# Altium schematic sheet CAN2XG_TCAN.SchDoc
size 431 x 279 mm; Organization: ORGANIZATION; Address1: ADDRESS 1; Address2: ADDRESS 2; Address3: ADDRESS 3; Address4: ADDRESS 4; Revision: -; ENG_APP_DATE: --/--/--; DSN_APP_DATE: --/--/--; CHK_APP_DATE: --/--/--
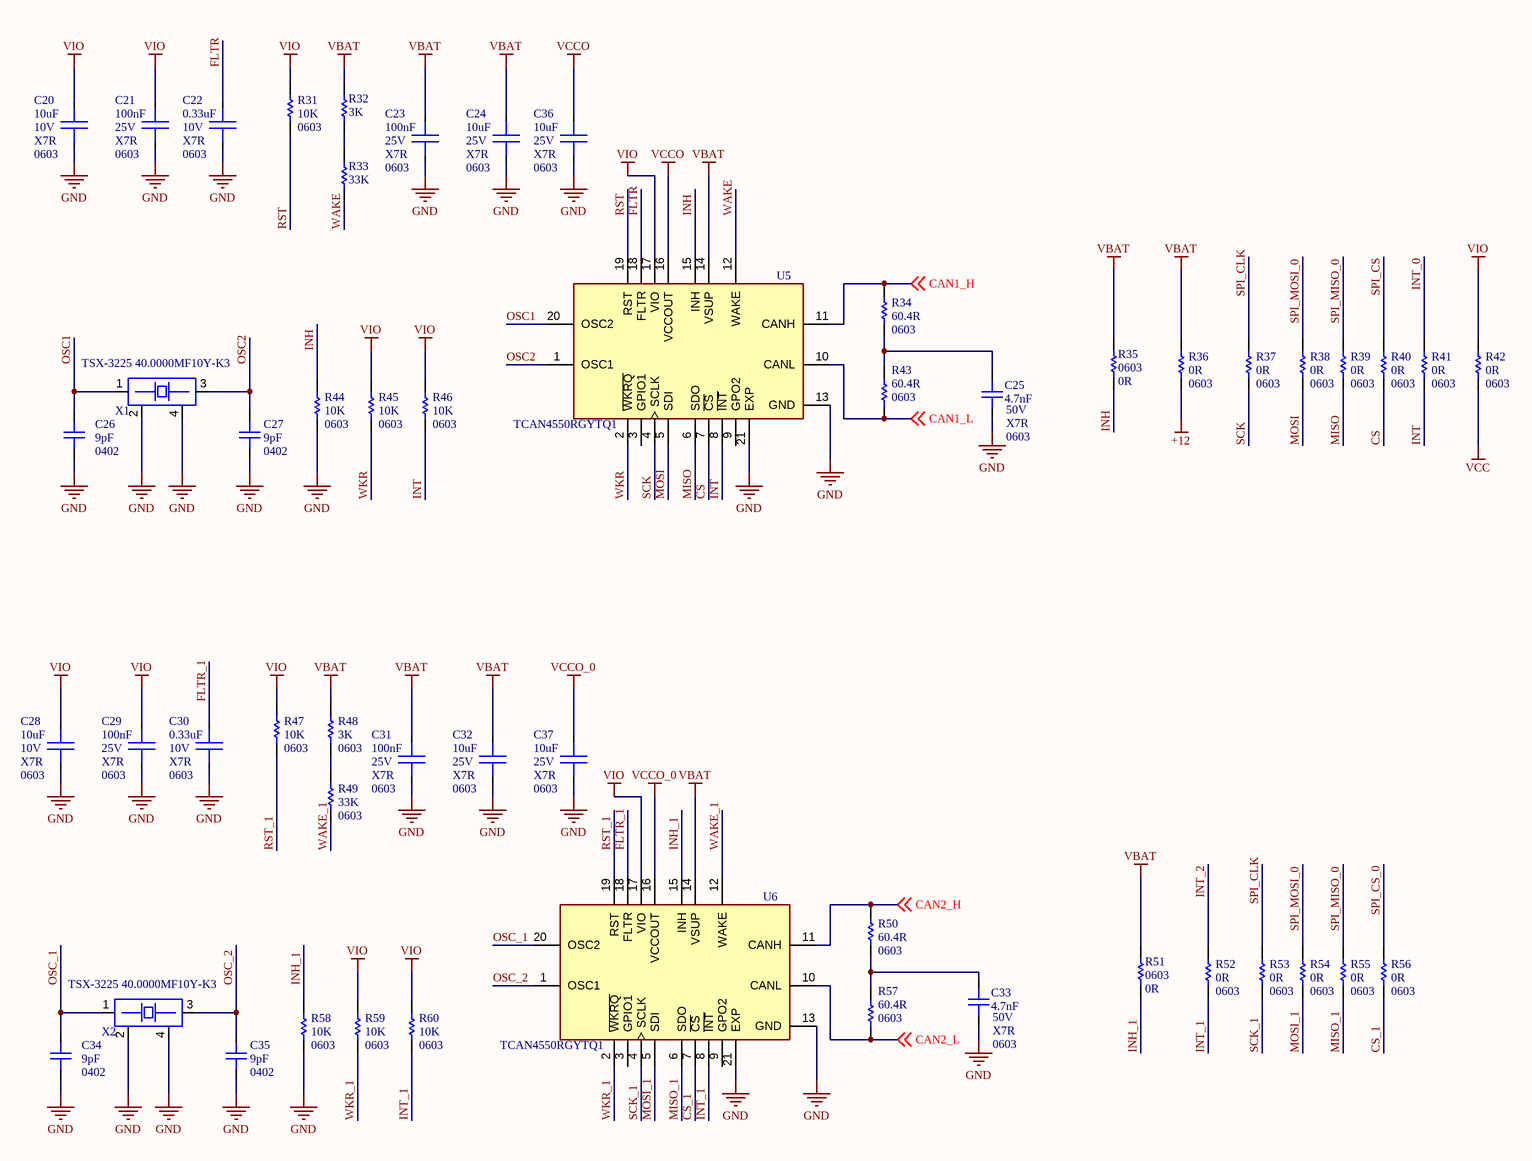
[diagram p0: CAN2XG_TCAN.SchDoc]

## Parts
C20  value 10uF  Voltage: 10V  Dielectirc: X7R  Case/Package: 0603  [CAP-0603]
C21  value 100nF  Voltage: 25V  Dielectirc: X7R  Case/Package: 0603  [CAP-0603]
C22  value 0.33uF  Voltage: 10V  Dielectirc: X7R  Case/Package: 0603  [CAP-0603]
C23  value 100nF  Voltage: 25V  Dielectirc: X7R  Case/Package: 0603  [CAP-0603]
C24  value 10uF  Voltage: 25V  Dielectirc: X7R  Case/Package: 0603  [CAP-0603]
C25  value 4.7nF  Voltage: 50V  Dielectric: X7R  Case/Package: 0603  [CAP-0603]
C26  value 9pF  Case/Package: 0402  [CAPC0402]
C27  value 9pF  Case/Package: 0402  [CAPC0402]
C28  value 10uF  Voltage: 10V  Dielectirc: X7R  Case/Package: 0603  [CAP-0603]
C29  value 100nF  Voltage: 25V  Dielectirc: X7R  Case/Package: 0603  [CAP-0603]
C30  value 0.33uF  Voltage: 10V  Dielectirc: X7R  Case/Package: 0603  [CAP-0603]
C31  value 100nF  Voltage: 25V  Dielectirc: X7R  Case/Package: 0603  [CAP-0603]
C32  value 10uF  Voltage: 25V  Dielectirc: X7R  Case/Package: 0603  [CAP-0603]
C33  value 4.7nF  Voltage: 50V  Dielectric: X7R  Case/Package: 0603  [CAP-0603]
C34  value 9pF  Case/Package: 0402  [CAPC0402]
C35  value 9pF  Case/Package: 0402  [CAPC0402]
C36  value 10uF  Voltage: 25V  Dielectirc: X7R  Case/Package: 0603  [CAP-0603]
C37  value 10uF  Voltage: 25V  Dielectirc: X7R  Case/Package: 0603  [CAP-0603]
R31  value 10K  Case/Package: 0603  [RESC0603]
R32  value 3K  [RESC0603]
R33  value 33K  [RESC0603]
R34  value 60.4R  Case/Package: 0603  [RESC0603]
R35  value 0R  Case/Package: 0603  [RESC0603]  (no BOM)
R36  value 0R  Case/Package: 0603  [RESC0603]
R37  value 0R  Case/Package: 0603  [RESC0603]
R38  value 0R  Case/Package: 0603  [RESC0603]
R39  value 0R  Case/Package: 0603  [RESC0603]
R40  value 0R  Case/Package: 0603  [RESC0603]
R41  value 0R  Case/Package: 0603  [RESC0603]
R42  value 0R  Case/Package: 0603  [RESC0603]
R43  value 60.4R  Case/Package: 0603  [RESC0603]
R44  value 10K  Case/Package: 0603  [RESC0603]
R45  value 10K  Case/Package: 0603  [RESC0603]
R46  value 10K  Case/Package: 0603  [RESC0603]
R47  value 10K  Case/Package: 0603  [RESC0603]
R48  value 3K  Case/Package: 0603  [RESC0603]
R49  value 33K  Case/Package: 0603  [RESC0603]
R50  value 60.4R  Case/Package: 0603  [RESC0603]
R51  value 0R  Case/Package: 0603  [RESC0603]  (no BOM)
R52  value 0R  Case/Package: 0603  [RESC0603]
R53  value 0R  Case/Package: 0603  [RESC0603]
R54  value 0R  Case/Package: 0603  [RESC0603]
R55  value 0R  Case/Package: 0603  [RESC0603]
R56  value 0R  Case/Package: 0603  [RESC0603]
R57  value 60.4R  Case/Package: 0603  [RESC0603]
R58  value 10K  Case/Package: 0603  [RESC0603]
R59  value 10K  Case/Package: 0603  [RESC0603]
R60  value 10K  Case/Package: 0603  [RESC0603]
U5  (no value)  [IC_TCAN4550RGYTQ1]
U6  (no value)  [IC_TCAN4550RGYTQ1]
X1  Manufacturer Part Number: TSX-3225 40.0000MF10Y-K3  [Crystal_3225]
X2  Manufacturer Part Number: TSX-3225 40.0000MF10Y-K3  [Crystal_3225]

## Nets
+12: R36.1
GND: C20.1 C21.1 C22.1 C23.1 C24.1 C25.1 C26.1 C27.1 C28.1 C29.1 C30.1 C31.1 C32.1 C33.1 C34.1 C35.1 C36.1 C37.1 R44.1 R58.1 U5.13(GND) U5.21(EXP) U6.13(GND) U6.21(EXP) X1.2 X1.4 X2.2 X2.4
VBAT: C23.2 C24.2 C31.2 C32.2 R32.2 R35.1 R36.2 R48.2 R51.1 U5.14(VSUP) U6.14(VSUP)
VCC: R42.1
VCCO: C36.2 U5.16(VCCOUT)
VCCO_0: C37.2 U6.16(VCCOUT)
VIO: C20.2 C21.2 C28.2 C29.2 R31.2 R42.2 R45.2 R46.2 R47.2 R59.2 R60.2 U5.17(VIO) U6.17(VIO)
CAN1_H: R34.2 U5.11(CANH) ; off-sheet CAN1_H
CAN1_L: R43.1 U5.10(CANL) ; off-sheet CAN1_L
CAN2_H: R50.2 U6.11(CANH) ; off-sheet CAN2_H
CAN2_L: R57.1 U6.10(CANL) ; off-sheet CAN2_L
CS: R40.1 U5.7(~{CS})
CS_1: R56.1 U6.7(~{CS})
FLTR: C22.2 U5.18(FLTR)
FLTR_1: C30.2 U6.18(FLTR)
INH: R35.2 R44.2 U5.15(INH)
INH_1: R51.2 R58.2 U6.15(INH)
INT: R41.1 R46.1 U5.8(~{INT})
INT_0: R41.2
INT_1: R52.1 R60.1 U6.8(~{INT})
INT_2: R52.2
MISO: R39.1 U5.6(SDO)
MISO_1: R55.1 U6.6(SDO)
MOSI: R38.1 U5.5(SDI)
MOSI_1: R54.1 U6.5(SDI)
OSC1: C26.2 U5.20(OSC2) X1.1
OSC2: C27.2 U5.1(OSC1) X1.3
OSC_1: C34.2 U6.20(OSC2) X2.1
OSC_2: C35.2 U6.1(OSC1) X2.3
RST: R31.1 U5.19(RST)
RST_1: R47.1 U6.19(RST)
SCK: R37.1 U5.4(SCLK)
SCK_1: R53.1 U6.4(SCLK)
SPI_CLK: R37.2 R53.2
SPI_CS: R40.2
SPI_CS_0: R56.2
SPI_MISO_0: R39.2 R55.2
SPI_MOSI_0: R38.2 R54.2
WAKE: R33.1 U5.12(WAKE)
WAKE_1: R49.1 U6.12(WAKE)
WKR: R45.1 U5.2(~{WKRQ})
WKR_1: R59.1 U6.2(~{WKRQ})
NetC25_2: C25.2 R34.1 R43.2
NetC33_2: C33.2 R50.1 R57.2
NetR32_1: R32.1 R33.2
NetR48_1: R48.1 R49.2

Not connected (* = marked no-connect by the designer): U5 3(GPIO1) 9(GPO2); U6 3(GPIO1) 9(GPO2)

## Notes on the sheet
- DWG. NO.
- REV.
- SHT.
- THIS DOCUMENT AND THE DATA DISCLOSED HEREIN OR HEREWITH IS THE PROPERTY OF ALTIUM LIMITED AND MAY BE FREELY DISTRIBUTED IN WHOLE. NO RIGHTS ARE RESERVED OR EXPRESS OR IMPLIED WARANTEE GIVEN.
- REVISION
- DESCRIPTION
- DATE
- APPROVED
- ENG:
- APPROVALS
- PROJECT
- DSN:
- CHK:
- REFERENCE DOCUMENTS
- PROJECT REVISION:
- TITLE
- DOCUMENT REVISION:
- DESIGN ITEM:
- BOM:
- FAB DWG:
- PCB DWG:
- ASSY DWG:
- SCALE:
- SIZE
- B
- CAGE CODE
- FILE NAME
- DWG NO.
- SHEET
- OF
- REV

## Library data of the parts
C20 C24 C28 C32 C36 C37 = C10uF  0603: CAP CER 10uF 25V  0603
C21 C23 C29 C31 = C10uF  0603: CAP CER 100nF 25V X7R 0603
C22 C30 = C10uF  0603: CAP CER 0.33uF 10V  0603
C25 C33 = CS0805KRX7RYBB472: CAP CER 4.7nF 50V X7R 0603; ComponentLink1URL: https://datasheet.ciiva.com/204/cx7r-204728.pdf?src-supplier=Digi-Key; ComponentLink1Description: https://datasheet.ciiva.com/204/cx7r-204728.pdf?src-supplier=Digi-Key; ComponentLink2URL: https://datasheet.ciiva.com/5418/cx7r-218113-5418187.pdf?src-supplier=Mouser; ComponentLink2Description: https://datasheet.ciiva.com/5418/cx7r-218113-5418187.pdf?src-supplier=Mouser
C26 C27 C34 C35 = CQ0805BRNPOYBN8R2: CAP CER 9PF 50V X7R 0402; ComponentLink1URL: https://datasheet.ciiva.com/204/cx7r-204728.pdf?src-supplier=Digi-Key; ComponentLink1Description: https://datasheet.ciiva.com/204/cx7r-204728.pdf?src-supplier=Digi-Key; ComponentLink2URL: https://datasheet.ciiva.com/5418/cx7r-218113-5418187.pdf?src-supplier=Mouser; ComponentLink2Description: https://datasheet.ciiva.com/5418/cx7r-218113-5418187.pdf?src-supplier=Mouser; Voltage: 50V
R31 R44-R47 R58-R60 = ERJ6ENF1002V: Thick Film Resistor -  10K, 1%, 0603
  R45 R46 R59 R60: ComponentLink1URL: https://datasheet.ciiva.com/11808/0900766b80f80784-11808080.pdf?src-supplier=RSComponents; ComponentLink1Description: https://datasheet.ciiva.com/11808/0900766b80f80784-11808080.pdf?src-supplier=RSComponents; ComponentLink2URL: https://datasheet.ciiva.com/16514/aoa0000ce2-16514021.pdf?src-supplier=Avnet+Asia; ComponentLink2Description: https://datasheet.ciiva.com/16514/aoa0000ce2-16514021.pdf?src-supplier=Avnet+Asia; ComponentLink3URL: https://datasheet.ciiva.com/27055/1988971-27055733.pdf?src-supplier=Jameco; ComponentLink3Description: https://datasheet.ciiva.com/27055/1988971-27055733.pdf?src-supplier=Jameco; ComponentLink4URL: https://datasheet.ciiva.com/16759/70260748-16759350.pdf?src-supplier=Allied+Electronics; ComponentLink4Description: https://datasheet.ciiva.com/16759/70260748-16759350.pdf?src-supplier=Allied+Electronics; ComponentLink5URL: https://datasheet.ciiva.com/16725/70260748-16725031.pdf?src-supplier=Allied+Electronics; ComponentLink5Description: https://datasheet.ciiva.com/16725/70260748-16725031.pdf?src-supplier=Allied+Electronics; ComponentLink6URL: https://datasheet.ciiva.com/7830/426256-7830745.pdf?src-supplier=Element14; ComponentLink6Description: https://datasheet.ciiva.com/7830/426256-7830745.pdf?src-supplier=Element14; ComponentLink7URL: https://datasheet.ciiva.com/46372/1678782-46372714.pdf?src-supplier=Element14; ComponentLink7Description: https://datasheet.ciiva.com/46372/1678782-46372714.pdf?src-supplier=Element14; ComponentLink8URL: https://datasheet.ciiva.com/46372/1678782-46372715.pdf?src-supplier=Element14; ComponentLink8Description: https://datasheet.ciiva.com/46372/1678782-46372715.pdf?src-supplier=Element14; ComponentLink9URL: https://datasheet.ciiva.com/17212/aoa0000ce2-17212108.pdf?src-supplier=Avnet+Europe; ComponentLink9Description: https://datasheet.ciiva.com/17212/aoa0000ce2-17212108.pdf?src-supplier=Avnet+Europe; ComponentLink10URL: https://datasheet.ciiva.com/30140/aoa0000ce2-30140236.pdf?src-supplier=Onlinecomponents.com; ComponentLink10Description: https://datasheet.ciiva.com/30140/aoa0000ce2-30140236.pdf?src-supplier=Onlinecomponents.com
R32 R48 = ERJ6ENF1002V: Thick Film Resistor -  3K, 1%, 0603
  R32: Case/Package: 0603; Parameter 1: *
  R48: ComponentLink1URL: https://datasheet.ciiva.com/11808/0900766b80f80784-11808080.pdf?src-supplier=RSComponents; ComponentLink1Description: https://datasheet.ciiva.com/11808/0900766b80f80784-11808080.pdf?src-supplier=RSComponents; ComponentLink2URL: https://datasheet.ciiva.com/16514/aoa0000ce2-16514021.pdf?src-supplier=Avnet+Asia; ComponentLink2Description: https://datasheet.ciiva.com/16514/aoa0000ce2-16514021.pdf?src-supplier=Avnet+Asia; ComponentLink3URL: https://datasheet.ciiva.com/27055/1988971-27055733.pdf?src-supplier=Jameco; ComponentLink3Description: https://datasheet.ciiva.com/27055/1988971-27055733.pdf?src-supplier=Jameco; ComponentLink4URL: https://datasheet.ciiva.com/16759/70260748-16759350.pdf?src-supplier=Allied+Electronics; ComponentLink4Description: https://datasheet.ciiva.com/16759/70260748-16759350.pdf?src-supplier=Allied+Electronics; ComponentLink5URL: https://datasheet.ciiva.com/16725/70260748-16725031.pdf?src-supplier=Allied+Electronics; ComponentLink5Description: https://datasheet.ciiva.com/16725/70260748-16725031.pdf?src-supplier=Allied+Electronics; ComponentLink6URL: https://datasheet.ciiva.com/7830/426256-7830745.pdf?src-supplier=Element14; ComponentLink6Description: https://datasheet.ciiva.com/7830/426256-7830745.pdf?src-supplier=Element14; ComponentLink7URL: https://datasheet.ciiva.com/46372/1678782-46372714.pdf?src-supplier=Element14; ComponentLink7Description: https://datasheet.ciiva.com/46372/1678782-46372714.pdf?src-supplier=Element14; ComponentLink8URL: https://datasheet.ciiva.com/46372/1678782-46372715.pdf?src-supplier=Element14; ComponentLink8Description: https://datasheet.ciiva.com/46372/1678782-46372715.pdf?src-supplier=Element14; ComponentLink9URL: https://datasheet.ciiva.com/17212/aoa0000ce2-17212108.pdf?src-supplier=Avnet+Europe; ComponentLink9Description: https://datasheet.ciiva.com/17212/aoa0000ce2-17212108.pdf?src-supplier=Avnet+Europe; ComponentLink10URL: https://datasheet.ciiva.com/30140/aoa0000ce2-30140236.pdf?src-supplier=Onlinecomponents.com; ComponentLink10Description: https://datasheet.ciiva.com/30140/aoa0000ce2-30140236.pdf?src-supplier=Onlinecomponents.com
R33 R49 = ERJ6ENF1002V: Thick Film Resistor -  33K, 1%, 0603
  R33: ComponentLink1URL: https://datasheet.ciiva.com/11808/0900766b80f80784-11808080.pdf?src-supplier=RSComponents; ComponentLink1Description: https://datasheet.ciiva.com/11808/0900766b80f80784-11808080.pdf?src-supplier=RSComponents; ComponentLink2URL: https://datasheet.ciiva.com/16514/aoa0000ce2-16514021.pdf?src-supplier=Avnet+Asia; ComponentLink2Description: https://datasheet.ciiva.com/16514/aoa0000ce2-16514021.pdf?src-supplier=Avnet+Asia; ComponentLink3URL: https://datasheet.ciiva.com/27055/1988971-27055733.pdf?src-supplier=Jameco; ComponentLink3Description: https://datasheet.ciiva.com/27055/1988971-27055733.pdf?src-supplier=Jameco; ComponentLink4URL: https://datasheet.ciiva.com/16759/70260748-16759350.pdf?src-supplier=Allied+Electronics; ComponentLink4Description: https://datasheet.ciiva.com/16759/70260748-16759350.pdf?src-supplier=Allied+Electronics; ComponentLink5URL: https://datasheet.ciiva.com/16725/70260748-16725031.pdf?src-supplier=Allied+Electronics; ComponentLink5Description: https://datasheet.ciiva.com/16725/70260748-16725031.pdf?src-supplier=Allied+Electronics; ComponentLink6URL: https://datasheet.ciiva.com/7830/426256-7830745.pdf?src-supplier=Element14; ComponentLink6Description: https://datasheet.ciiva.com/7830/426256-7830745.pdf?src-supplier=Element14; ComponentLink7URL: https://datasheet.ciiva.com/46372/1678782-46372714.pdf?src-supplier=Element14; ComponentLink7Description: https://datasheet.ciiva.com/46372/1678782-46372714.pdf?src-supplier=Element14; ComponentLink8URL: https://datasheet.ciiva.com/46372/1678782-46372715.pdf?src-supplier=Element14; ComponentLink8Description: https://datasheet.ciiva.com/46372/1678782-46372715.pdf?src-supplier=Element14; ComponentLink9URL: https://datasheet.ciiva.com/17212/aoa0000ce2-17212108.pdf?src-supplier=Avnet+Europe; ComponentLink9Description: https://datasheet.ciiva.com/17212/aoa0000ce2-17212108.pdf?src-supplier=Avnet+Europe; ComponentLink10URL: https://datasheet.ciiva.com/30140/aoa0000ce2-30140236.pdf?src-supplier=Onlinecomponents.com; ComponentLink10Description: https://datasheet.ciiva.com/30140/aoa0000ce2-30140236.pdf?src-supplier=Onlinecomponents.com; Case/Package: 0603; Parameter 1: *
R34 R43 R50 R57 = RC0805FR-0760R4L: Thick Film Resistor -  60.4R, 1%, 0603; ComponentLink1URL: https://industrial.panasonic.com/sa/system/files/data/download/catalog/id_fixed-resistors_e_2.pdf?src-supplier=Digi-Key; ComponentLink1Description: https://industrial.panasonic.com/sa/system/files/data/download/catalog/id_fixed-resistors_e_2.pdf?src-supplier=Digi-Key; ComponentLink2URL: https://industrial.panasonic.com/cdbs/www-data/pdf/RDM0000/DMM0000COL5.pdf?src-supplier=Digi-Key; ComponentLink2Description: https://industrial.panasonic.com/cdbs/www-data/pdf/RDM0000/DMM0000COL5.pdf?src-supplier=Digi-Key
R35-R42 R51-R56 = RC0805FR-0760R4L: Thick Film Resistor -  0R , 1%, 0603; ComponentLink1URL: https://industrial.panasonic.com/sa/system/files/data/download/catalog/id_fixed-resistors_e_2.pdf?src-supplier=Digi-Key; ComponentLink1Description: https://industrial.panasonic.com/sa/system/files/data/download/catalog/id_fixed-resistors_e_2.pdf?src-supplier=Digi-Key; ComponentLink2URL: https://industrial.panasonic.com/cdbs/www-data/pdf/RDM0000/DMM0000COL5.pdf?src-supplier=Digi-Key; ComponentLink2Description: https://industrial.panasonic.com/cdbs/www-data/pdf/RDM0000/DMM0000COL5.pdf?src-supplier=Digi-Key
U5 U6 = TCAN4550RGYTQ1: Automotive system basis chip (SBC) with integrated CAN FD controller & transceiver 20-VQFN -40 to 125; Package: None; Price: None; Value: *; Manufacturer Part Number: TCAN4550RGYTQ1; Availability: Unavailable
X1 X2 = CRYSTAL_1: CRYSTAL 40.0000MHZ 10PF SMD